# Altium project Sim Test.PrjPcb
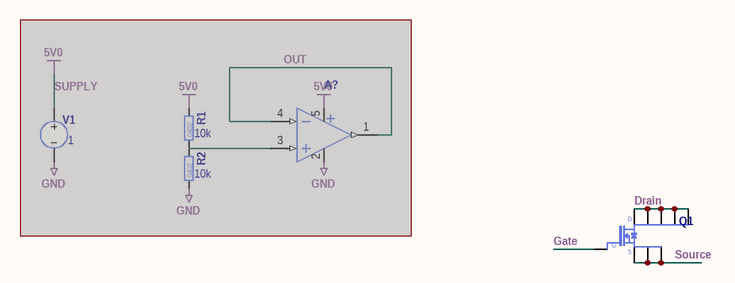
[diagram p0: Sim.SchDoc]
1 sheet, 5 parts. Net scope: global (net labels, ports and power ports of the same name join across sheets).
Board file: Simple Transistor PQFN No Vias.PcbDoc

## Sheet Sim.SchDoc
size A

### Parts
A?  MCP6001T-IOT  [SOT23-5_SC74A_SOT753_M]  (value not drawn)  (masked out: inside a compile mask, not in the netlist)
Q1  CSD18543Q3A  [PQFN65P330X332X105_HS-9N]  (value not drawn)
R1  Resistance: 10k  Case/Package: 0402  [R_0402_1005]  (hidden comment: R)  (masked out: inside a compile mask, not in the netlist)
R2  Resistance: 10k  Case/Package: 0402  [R_0402_1005]  (hidden comment: R)  (masked out: inside a compile mask, not in the netlist)
V1  value 1  (hidden comment: VSRC)  (masked out: inside a compile mask, not in the netlist)

### Nets
Drain: Q1.5(D) Q1.6(D) Q1.7(D) Q1.8(D) Q1.9(D)
Gate: Q1.4(G)
Source: Q1.1(S) Q1.2(S) Q1.3(S)

### Library data of the parts
A? = MCP6001T-I/OT: Operational Amplifier, Single, 1 MHz, 1, 0.6 V/ s, 1.8V to 6V,; Manufacturer: Microchip; Gain Bandwidth Product: 1M; Input Offset Voltage (Vos): 4.5m; Max Supply Voltage: 6; Min Supply Voltage: 1.8; Number of Amplifiers: 1; Part Number: MCP6001T-I/OT; Manufacturer Part Number: MCP6001T-I/OT; Case/Package: SOT-23; Mount: Surface Mount; Height: 1.3mm; HelpURL: https://datasheet.octopart.com/MCP6001UT-I/OT-Microchip-datasheet-8823409.pdf; Max Operating Temperature: 85°C
Q1 = CSD18543Q3A: NMOS Transistor 60V 8.1mR; Manufacturer: Texas Instruments; Continuous Drain Current (ID): 35A; Drain to Source Voltage: 60; Max Power Dissipation: 2.8W; Drain to Source Resistance: 8.1; Threshold Voltage: 2.7; Part Number: CSD18543Q3A; Case/Package: SON 3.3-mm × 3.3-mm; Manufacturer Part Number: CSD18543Q3A; Mount: surface mount; Height: o.9; HelpURL: http://www.ti.com/lit/ds/symlink/csd18543q3a.pdf; Max Operating Temperature: 150°C; Polarization: NMOS; RoHS: Compliant
R1 R2 = R_10K_0402_1: Thick Film Resistor; Manufacturer: Yageo; Manufacturer Part Number: RC0402FR-0710KL; Tolerance: 1%; Voltage Rating (DC): 50V; Power Rating: 63mW; Stats: MK; Part Number: R_10K_0402_1; Mount: Surface Mount; Height: 0.4mm; HelpURL: http://datasheet.octopart.com/RC0402FR-0710KL-Yageo-datasheet-10408619.pdf; RoHS: Compliant; Max Operating Temperature: 155; Supplier 1: Mouser; Supplier Part Number 1: 603-RC0402FR-0710KL
V1 = VSRC: Voltage Source; AC Phase: 0; Note: Updated model; AC Magnitude: 0; Part Number: VSRC; Component Name: VSRC; ComponentType: Simulation